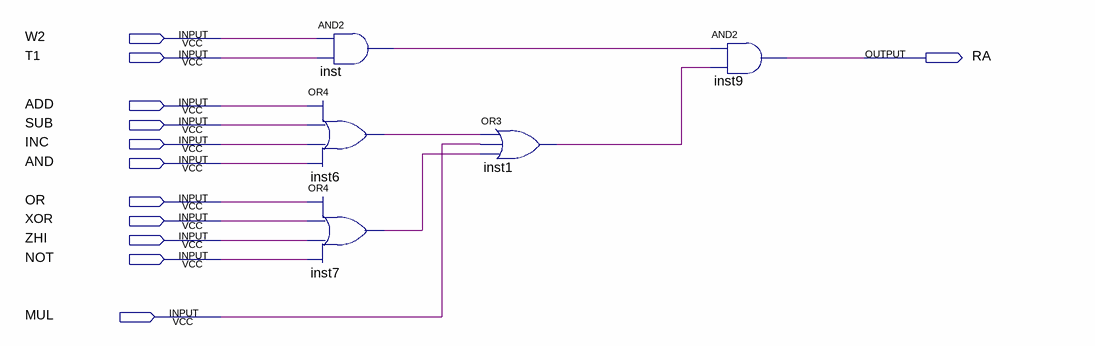
[diagram p0: schematic sheet]
// Quartus schematic RA.bdf as structural Verilog: 5 symbols, 12 pins
module RA (
  input  W2,
  input  T1,
  input  ADD,
  input  SUB,
  input  INC,
  input  AND,
  input  OR,
  input  XOR,
  input  ZHI,
  input  NOT,
  input  MUL,
  output RA
);

  wire inst1_out, inst6_out, inst7_out, inst_out;

  and inst (inst_out, W2, T1);
  or inst6 (inst6_out, ADD, SUB, INC, AND);
  or inst7 (inst7_out, OR, XOR, ZHI, NOT);
  or inst1 (inst1_out, inst6_out, MUL, inst7_out);
  and inst9 (RA, inst_out, inst1_out);
endmodule
